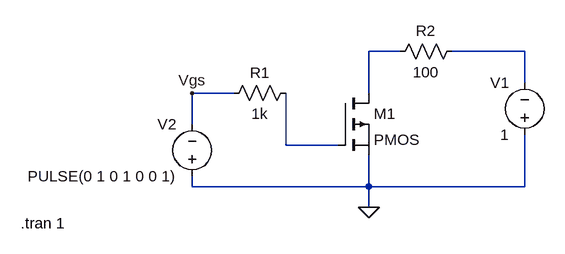
[diagram p0: schematic PMOS Vth.asc]
PMOS Vth.asc, the LTspice schematic file:
Version 4
SHEET 1 880 680
WIRE 272 48 224 48
WIRE 464 48 352 48
WIRE 464 96 464 48
WIRE 16 112 -48 112
WIRE 224 112 224 48
WIRE -48 160 -48 112
WIRE 96 192 96 112
WIRE 176 192 96 192
WIRE -48 256 -48 240
WIRE 224 256 224 208
WIRE 224 256 -48 256
WIRE 464 256 464 176
WIRE 464 256 224 256
WIRE 224 288 224 256
FLAG 224 288 0
FLAG -48 112 Vgs
SYMBOL pmos 176 112 R0
SYMATTR InstName M1
SYMBOL res 112 96 R90
WINDOW 0 0 56 VBottom 2
WINDOW 3 32 56 VTop 2
SYMATTR InstName R1
SYMATTR Value 1k
SYMBOL res 368 32 R90
WINDOW 0 0 56 VBottom 2
WINDOW 3 32 56 VTop 2
SYMATTR InstName R2
SYMATTR Value 100
SYMBOL voltage 464 192 R180
WINDOW 0 24 96 Left 2
WINDOW 3 24 16 Left 2
SYMATTR InstName V1
SYMATTR Value 1
SYMBOL voltage -48 256 R180
WINDOW 0 24 96 Left 2
WINDOW 3 24 16 Left 2
WINDOW 123 0 0 Left 0
WINDOW 39 0 0 Left 0
SYMATTR InstName V2
SYMATTR Value PULSE(0 1 0 1 0 0 1)
TEXT -312 312 Left 2 !.tran 1

The netlist it stands for:
* PMOS Vth.asc
M1 N001 N003 0 0 PMOS
R1 N003 Vgs 1k
R2 N002 N001 100
V1 0 N002 1
V2 0 Vgs PULSE(0 1 0 1 0 0 1)
.model NMOS NMOS
.model PMOS PMOS
.lib standard.mos
.tran 1
.backanno
.end